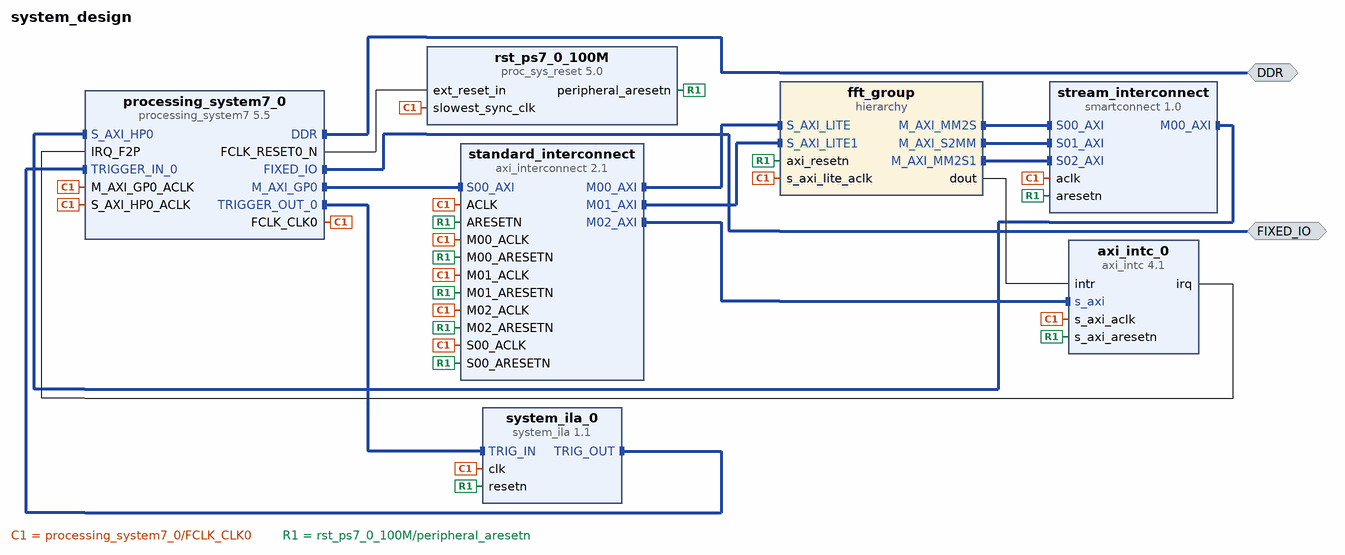
[diagram p0: block diagram of the top level]
# Vivado block design system_design, xc7z020clg400-1, Vivado 2019.1
create_bd_design system_design

create_bd_intf_port -mode Master -vlnv xilinx.com:interface:ddrx_rtl:1.0 DDR
create_bd_intf_port -mode Master -vlnv xilinx.com:display_processing_system7:fixedio_rtl:1.0 FIXED_IO

create_bd_cell -type ip -vlnv xilinx.com:ip:processing_system7:5.5 processing_system7_0
set_property -dict [list \
  CONFIG.PCW_APU_PERIPHERAL_FREQMHZ 650 \
  CONFIG.PCW_CRYSTAL_PERIPHERAL_FREQMHZ 50 \
  CONFIG.PCW_ENET0_ENET0_IO {MIO 16 .. 27} \
  CONFIG.PCW_ENET0_GRP_MDIO_ENABLE 1 \
  CONFIG.PCW_ENET0_GRP_MDIO_IO {MIO 52 .. 53} \
  CONFIG.PCW_ENET0_PERIPHERAL_ENABLE 1 \
  CONFIG.PCW_ENET0_RESET_ENABLE 1 \
  CONFIG.PCW_ENET0_RESET_IO {MIO 9} \
  CONFIG.PCW_ENET_RESET_ENABLE 1 \
  CONFIG.PCW_ENET_RESET_SELECT {Share reset pin} \
  CONFIG.PCW_FPGA0_PERIPHERAL_FREQMHZ 100 \
  CONFIG.PCW_FPGA1_PERIPHERAL_FREQMHZ 50 \
  CONFIG.PCW_FTM_CTI_IN0 BOTH \
  CONFIG.PCW_FTM_CTI_IN1 DISABLED \
  CONFIG.PCW_FTM_CTI_IN2 DISABLED \
  CONFIG.PCW_FTM_CTI_IN3 DISABLED \
  CONFIG.PCW_FTM_CTI_OUT0 BOTH \
  CONFIG.PCW_FTM_CTI_OUT1 DISABLED \
  CONFIG.PCW_FTM_CTI_OUT2 DISABLED \
  CONFIG.PCW_FTM_CTI_OUT3 DISABLED \
  CONFIG.PCW_GPIO_MIO_GPIO_ENABLE 1 \
  CONFIG.PCW_GPIO_MIO_GPIO_IO MIO \
  CONFIG.PCW_I2C_RESET_ENABLE 1 \
  CONFIG.PCW_IRQ_F2P_INTR 1 \
  CONFIG.PCW_M_AXI_GP0_FREQMHZ 10 \
  CONFIG.PCW_PERIPHERAL_BOARD_PRESET part0 \
  CONFIG.PCW_PRESET_BANK1_VOLTAGE {LVCMOS 1.8V} \
  CONFIG.PCW_QSPI_GRP_FBCLK_ENABLE 1 \
  CONFIG.PCW_QSPI_GRP_FBCLK_IO {MIO 8} \
  CONFIG.PCW_QSPI_GRP_SINGLE_SS_ENABLE 1 \
  CONFIG.PCW_QSPI_GRP_SINGLE_SS_IO {MIO 1 .. 6} \
  CONFIG.PCW_QSPI_PERIPHERAL_ENABLE 1 \
  CONFIG.PCW_QSPI_QSPI_IO {MIO 1 .. 6} \
  CONFIG.PCW_SD0_GRP_CD_ENABLE 1 \
  CONFIG.PCW_SD0_GRP_CD_IO {MIO 47} \
  CONFIG.PCW_SD0_GRP_WP_ENABLE 0 \
  CONFIG.PCW_SD0_PERIPHERAL_ENABLE 1 \
  CONFIG.PCW_SD0_SD0_IO {MIO 40 .. 45} \
  CONFIG.PCW_SDIO_PERIPHERAL_FREQMHZ 50 \
  CONFIG.PCW_SINGLE_QSPI_DATA_MODE x4 \
  CONFIG.PCW_S_AXI_HP0_FREQMHZ 10 \
  CONFIG.PCW_UART0_PERIPHERAL_ENABLE 1 \
  CONFIG.PCW_UART0_UART0_IO {MIO 14 .. 15} \
  CONFIG.PCW_UART1_PERIPHERAL_ENABLE 0 \
  CONFIG.PCW_UART_PERIPHERAL_FREQMHZ 100 \
  CONFIG.PCW_UIPARAM_DDR_BUS_WIDTH {16 Bit} \
  CONFIG.PCW_UIPARAM_DDR_FREQ_MHZ 525 \
  CONFIG.PCW_UIPARAM_DDR_PARTNO {MT41J256M16 RE-125} \
  CONFIG.PCW_USB0_PERIPHERAL_ENABLE 1 \
  CONFIG.PCW_USB0_RESET_ENABLE 1 \
  CONFIG.PCW_USB0_RESET_IO {MIO 46} \
  CONFIG.PCW_USB0_USB0_IO {MIO 28 .. 39} \
  CONFIG.PCW_USB_RESET_ENABLE 1 \
  CONFIG.PCW_USB_RESET_SELECT {Share reset pin} \
  CONFIG.PCW_USE_CROSS_TRIGGER 1 \
  CONFIG.PCW_USE_FABRIC_INTERRUPT 1 \
  CONFIG.PCW_USE_S_AXI_HP0 1 \
] [get_bd_cells processing_system7_0]
# 495 more settings of processing_system7_0 are not shown: defaults, MIO pin electricals, DDR timing, and values the tool derives
create_bd_cell -type ip -vlnv xilinx.com:ip:system_ila:1.1 system_ila_0
set_property -dict {CONFIG.C_TRIGIN_EN true CONFIG.C_TRIGOUT_EN true} [get_bd_cells system_ila_0]
create_bd_cell -type ip -vlnv xilinx.com:ip:proc_sys_reset:5.0 rst_ps7_0_100M
create_bd_cell -type ip -vlnv xilinx.com:ip:smartconnect:1.0 stream_interconnect
set_property -dict {CONFIG.NUM_SI 3} [get_bd_cells stream_interconnect]
create_bd_cell -type ip -vlnv xilinx.com:ip:axi_interconnect:2.1 standard_interconnect
set_property -dict {CONFIG.NUM_MI 3} [get_bd_cells standard_interconnect]
create_bd_cell -type hier fft_group
create_bd_cell -type ip -vlnv xilinx.com:ip:axi_intc:4.1 axi_intc_0
set_property -dict [list \
  CONFIG.C_CASCADE_MASTER 0 \
  CONFIG.C_DISABLE_SYNCHRONIZERS 1 \
  CONFIG.C_EN_CASCADE_MODE 0 \
  CONFIG.C_HAS_CIE 1 \
  CONFIG.C_HAS_FAST 0 \
  CONFIG.C_HAS_ILR 0 \
  CONFIG.C_HAS_IVR 1 \
  CONFIG.C_HAS_SIE 1 \
  CONFIG.C_IRQ_CONNECTION 0 \
  CONFIG.C_IRQ_IS_LEVEL 0 \
  CONFIG.C_MB_CLK_NOT_CONNECTED 1 \
  CONFIG.C_NUM_SW_INTR 0 \
] [get_bd_cells axi_intc_0]

# ---- hierarchy /fft_group ----
current_bd_instance /fft_group
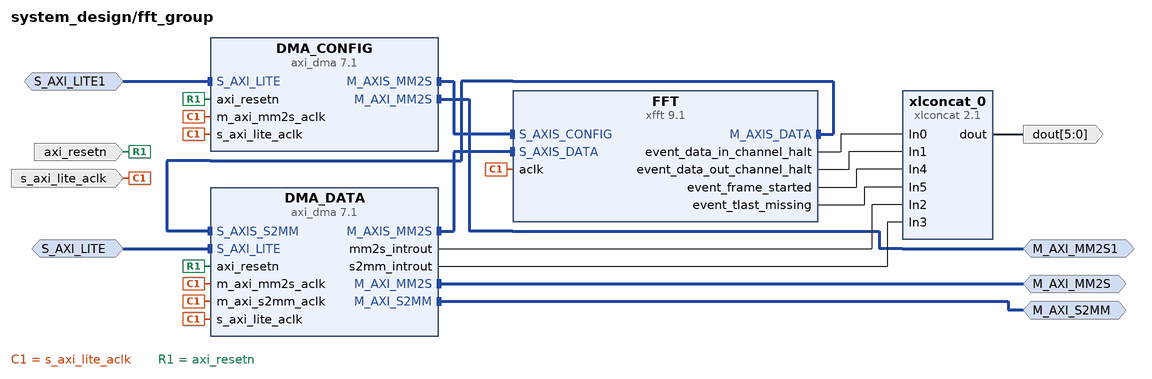
[diagram p1: block diagram inside /fft_group]
create_bd_intf_pin -mode Slave -vlnv xilinx.com:interface:aximm_rtl:1.0 S_AXI_LITE
create_bd_intf_pin -mode Master -vlnv xilinx.com:interface:aximm_rtl:1.0 M_AXI_MM2S
create_bd_intf_pin -mode Master -vlnv xilinx.com:interface:aximm_rtl:1.0 M_AXI_S2MM
create_bd_intf_pin -mode Slave -vlnv xilinx.com:interface:aximm_rtl:1.0 S_AXI_LITE1
create_bd_intf_pin -mode Master -vlnv xilinx.com:interface:aximm_rtl:1.0 M_AXI_MM2S1
create_bd_pin -dir I -type clk s_axi_lite_aclk
create_bd_pin -dir I -type rst axi_resetn
create_bd_pin -dir O -from 5 -to 0 dout

create_bd_cell -type ip -vlnv xilinx.com:ip:xfft:9.1 FFT
create_bd_cell -type ip -vlnv xilinx.com:ip:axi_dma:7.1 DMA_CONFIG
set_property -dict [list \
  CONFIG.c_include_mm2s 1 \
  CONFIG.c_include_s2mm 0 \
  CONFIG.c_include_sg 0 \
  CONFIG.c_m_axis_mm2s_tdata_width 16 \
] [get_bd_cells DMA_CONFIG]
create_bd_cell -type ip -vlnv xilinx.com:ip:axi_dma:7.1 DMA_DATA
set_property -dict {CONFIG.c_include_sg 0 CONFIG.c_sg_length_width 24} [get_bd_cells DMA_DATA]
create_bd_cell -type ip -vlnv xilinx.com:ip:xlconcat:2.1 xlconcat_0
set_property -dict {CONFIG.NUM_PORTS 6} [get_bd_cells xlconcat_0]

# ---- connections ----

current_bd_instance /fft_group
connect_bd_intf_net [get_bd_intf_pins FFT/M_AXIS_DATA] [get_bd_intf_pins DMA_DATA/S_AXIS_S2MM]
connect_bd_intf_net [get_bd_intf_pins S_AXI_LITE] [get_bd_intf_pins DMA_DATA/S_AXI_LITE]
connect_bd_intf_net -intf_net DMA_M_AXIS_MM2S [get_bd_intf_pins FFT/S_AXIS_DATA] [get_bd_intf_pins DMA_DATA/M_AXIS_MM2S]
connect_bd_intf_net -intf_net DMA_M_AXI_MM2S [get_bd_intf_pins M_AXI_MM2S] [get_bd_intf_pins DMA_DATA/M_AXI_MM2S]
connect_bd_intf_net [get_bd_intf_pins S_AXI_LITE1] [get_bd_intf_pins DMA_CONFIG/S_AXI_LITE]
connect_bd_intf_net [get_bd_intf_pins DMA_CONFIG/M_AXIS_MM2S] [get_bd_intf_pins FFT/S_AXIS_CONFIG]
connect_bd_intf_net -intf_net DMA_M_AXI_S2MM [get_bd_intf_pins M_AXI_S2MM] [get_bd_intf_pins DMA_DATA/M_AXI_S2MM]
connect_bd_intf_net [get_bd_intf_pins M_AXI_MM2S1] [get_bd_intf_pins DMA_CONFIG/M_AXI_MM2S]
connect_bd_net -net processing_system7_0_FCLK_CLK0 [get_bd_pins s_axi_lite_aclk] \
  [get_bd_pins DMA_DATA/s_axi_lite_aclk] [get_bd_pins DMA_DATA/m_axi_mm2s_aclk] [get_bd_pins DMA_DATA/m_axi_s2mm_aclk] \
  [get_bd_pins FFT/aclk] [get_bd_pins DMA_CONFIG/m_axi_mm2s_aclk] [get_bd_pins DMA_CONFIG/s_axi_lite_aclk]
connect_bd_net -net rst_ps7_0_100M_peripheral_aresetn [get_bd_pins axi_resetn] [get_bd_pins DMA_DATA/axi_resetn] [get_bd_pins DMA_CONFIG/axi_resetn]
connect_bd_net [get_bd_pins FFT/event_data_in_channel_halt] [get_bd_pins xlconcat_0/In0]
connect_bd_net [get_bd_pins FFT/event_data_out_channel_halt] [get_bd_pins xlconcat_0/In1]
connect_bd_net [get_bd_pins DMA_DATA/mm2s_introut] [get_bd_pins xlconcat_0/In2]
connect_bd_net [get_bd_pins DMA_DATA/s2mm_introut] [get_bd_pins xlconcat_0/In3]
connect_bd_net [get_bd_pins FFT/event_frame_started] [get_bd_pins xlconcat_0/In4]
connect_bd_net [get_bd_pins xlconcat_0/dout] [get_bd_pins dout]
connect_bd_net [get_bd_pins FFT/event_tlast_missing] [get_bd_pins xlconcat_0/In5]

current_bd_instance /
connect_bd_intf_net [get_bd_intf_ports DDR] [get_bd_intf_pins processing_system7_0/DDR]
connect_bd_intf_net [get_bd_intf_ports FIXED_IO] [get_bd_intf_pins processing_system7_0/FIXED_IO]
connect_bd_intf_net [get_bd_intf_pins processing_system7_0/TRIGGER_IN_0] [get_bd_intf_pins system_ila_0/TRIG_OUT]
connect_bd_intf_net -intf_net DMA_M_AXI_MM2S [get_bd_intf_pins fft_group/M_AXI_MM2S] [get_bd_intf_pins stream_interconnect/S00_AXI]
connect_bd_intf_net -intf_net axi_smc_M00_AXI [get_bd_intf_pins stream_interconnect/M00_AXI] [get_bd_intf_pins processing_system7_0/S_AXI_HP0]
connect_bd_intf_net [get_bd_intf_pins processing_system7_0/M_AXI_GP0] [get_bd_intf_pins standard_interconnect/S00_AXI]
connect_bd_intf_net -intf_net DMA_M_AXI_S2MM [get_bd_intf_pins stream_interconnect/S01_AXI] [get_bd_intf_pins fft_group/M_AXI_S2MM]
connect_bd_intf_net [get_bd_intf_pins standard_interconnect/M00_AXI] [get_bd_intf_pins fft_group/S_AXI_LITE]
connect_bd_intf_net [get_bd_intf_pins standard_interconnect/M01_AXI] [get_bd_intf_pins fft_group/S_AXI_LITE1]
connect_bd_intf_net [get_bd_intf_pins stream_interconnect/S02_AXI] [get_bd_intf_pins fft_group/M_AXI_MM2S1]
connect_bd_intf_net [get_bd_intf_pins processing_system7_0/TRIGGER_OUT_0] [get_bd_intf_pins system_ila_0/TRIG_IN]
connect_bd_intf_net [get_bd_intf_pins standard_interconnect/M02_AXI] [get_bd_intf_pins axi_intc_0/s_axi]
connect_bd_net [get_bd_pins processing_system7_0/FCLK_CLK0] \
  [get_bd_pins processing_system7_0/M_AXI_GP0_ACLK] [get_bd_pins rst_ps7_0_100M/slowest_sync_clk] \
  [get_bd_pins processing_system7_0/S_AXI_HP0_ACLK] [get_bd_pins system_ila_0/clk] [get_bd_pins stream_interconnect/aclk] \
  [get_bd_pins standard_interconnect/ACLK] [get_bd_pins standard_interconnect/S00_ACLK] \
  [get_bd_pins standard_interconnect/M00_ACLK] [get_bd_pins fft_group/s_axi_lite_aclk] \
  [get_bd_pins standard_interconnect/M01_ACLK] [get_bd_pins axi_intc_0/s_axi_aclk] \
  [get_bd_pins standard_interconnect/M02_ACLK]
connect_bd_net [get_bd_pins processing_system7_0/FCLK_RESET0_N] [get_bd_pins rst_ps7_0_100M/ext_reset_in]
connect_bd_net [get_bd_pins rst_ps7_0_100M/peripheral_aresetn] \
  [get_bd_pins system_ila_0/resetn] [get_bd_pins stream_interconnect/aresetn] [get_bd_pins standard_interconnect/S00_ARESETN] \
  [get_bd_pins standard_interconnect/M00_ARESETN] [get_bd_pins standard_interconnect/ARESETN] \
  [get_bd_pins fft_group/axi_resetn] [get_bd_pins standard_interconnect/M01_ARESETN] [get_bd_pins axi_intc_0/s_axi_aresetn] \
  [get_bd_pins standard_interconnect/M02_ARESETN]
connect_bd_net [get_bd_pins fft_group/dout] [get_bd_pins axi_intc_0/intr]
connect_bd_net [get_bd_pins axi_intc_0/irq] [get_bd_pins processing_system7_0/IRQ_F2P]

# ---- address map ----
assign_bd_address -offset 0x00000000 -range 512M -target_address_space [get_bd_addr_spaces fft_group/DMA_CONFIG/Data_MM2S] [get_bd_addr_segs processing_system7_0/S_AXI_HP0/HP0_DDR_LOWOCM]
assign_bd_address -offset 0x00000000 -range 512M -target_address_space [get_bd_addr_spaces fft_group/DMA_DATA/Data_MM2S] [get_bd_addr_segs processing_system7_0/S_AXI_HP0/HP0_DDR_LOWOCM]
assign_bd_address -offset 0x00000000 -range 512M -target_address_space [get_bd_addr_spaces fft_group/DMA_DATA/Data_S2MM] [get_bd_addr_segs processing_system7_0/S_AXI_HP0/HP0_DDR_LOWOCM]
assign_bd_address -offset 0x40400000 -range 64K -target_address_space [get_bd_addr_spaces processing_system7_0/Data] [get_bd_addr_segs fft_group/DMA_DATA/S_AXI_LITE/Reg]
assign_bd_address -offset 0x40410000 -range 64K -target_address_space [get_bd_addr_spaces processing_system7_0/Data] [get_bd_addr_segs fft_group/DMA_CONFIG/S_AXI_LITE/Reg]
assign_bd_address -offset 0x41800000 -range 64K -target_address_space [get_bd_addr_spaces processing_system7_0/Data] [get_bd_addr_segs axi_intc_0/S_AXI/Reg]

validate_bd_design
save_bd_design
